# Altium schematic sheet 智能灯.SchDoc
size A4
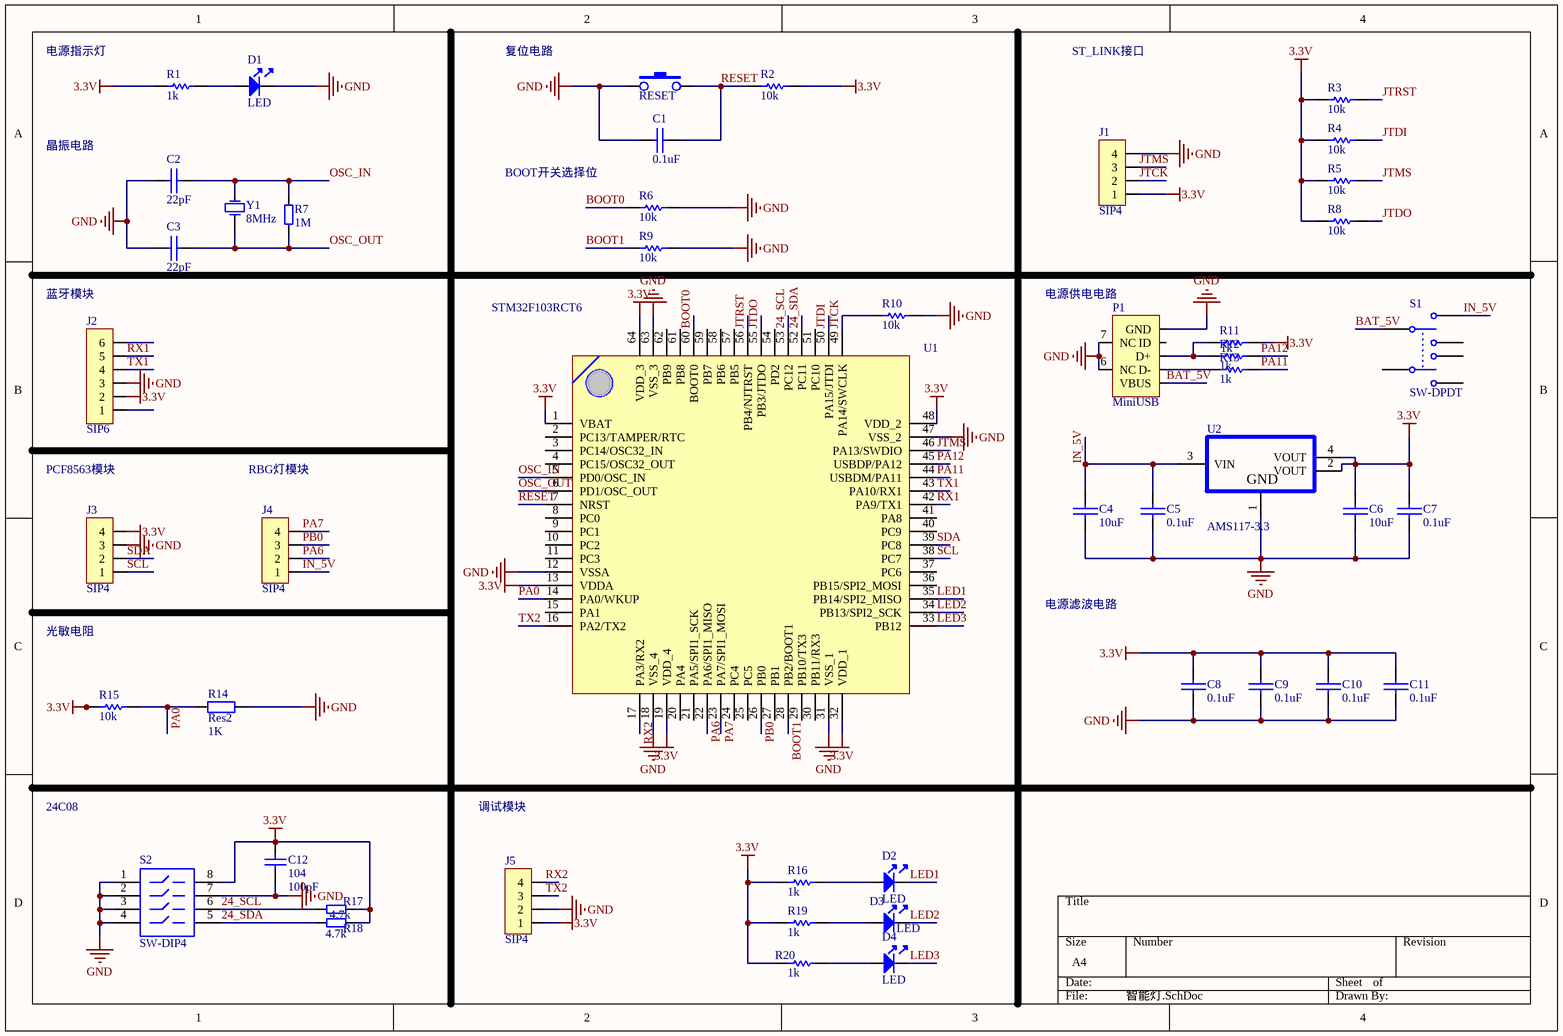
[diagram p0: 智能灯.SchDoc]

## Parts
C1  0.1uF  [0805c]
C2  22pF  [0805c]
C3  22pF  [0805c]
C4  10uF  [0805c]
C5  0.1uF  [0805c]
C6  10uF  [0805c]
C7  0.1uF  [0805c]
C8  0.1uF  [0805c]
C9  0.1uF  [0805c]
C10  0.1uF  [0805c]
C11  0.1uF  [0805c]
C12  104  value 100pF  [0805C]
D1  LED  [0805d]
D2  LED  [0805d]
D3  LED  [0805d]
D4  LED  [0805d]
J1  SIP4  [P4_2.54-1]
J2  SIP6  [P6_2.54-3]
J3  SIP4  [P4_2.54-3]
J4  SIP4  [P4_2.54-1]
J5  SIP4  [P4_2.54-1]
P1  MiniUSB  [USB_MINI_5P]
R1  1k  [0805r]
R2  10k  [0805r]
R3  10k  [0805r]
R4  10k  [0805r]
R5  10k  [0805r]
R6  10k  [0805r]
R7  1M  [0805R]
R8  10k  [0805r]
R9  10k  [0805r]
R10  10k  [0805r]
R11  1k  [0805r]
R12  1k  [0805r]
R13  1k  [0805r]
R14  Res2  value 1K  [AXIAL0.3]
R15  10k  [0805R]
R16  1k  [0603R]
R17  4.7k  [0805R]
R18  4.7k  [0805R]
R19  1k  [0603R]
R20  1k  [0603R]
RESET  SW-PB_DIP  [KEY_SIM2P]  (value not drawn)
S1  SW-DPDT  [DPDT-6]
S2  SW-DIP4  [DIP-8]
U1  STM32F103RCT6  [LQFP64-0.5MM]
U2  AMS117-3.3  [SOT-223]
Y1  8MHz  [0.1UF]

## Nets
3.3V: C6.1 C7.1 C8.1 C9.1 C10.1 C11.1 C12.2 J1.1 J2.2 J3.4 J5.1 R1.1 R2.2 R3.1 R4.1 R5.1 R8.1 R11.2 R15.1 R16.1 R17.2 R18.2 R19.1 R20.1 S2.8 U1.1(VBAT) U1.13(VDDA) U1.19(VDD_4) U1.32(VDD_1) U1.48(VDD_2) U1.64(VDD_3) U2.2(VOUT) U2.4(VOUT)
GND: C1.2 C2.1 C3.1 C4.2 C5.2 C6.2 C7.2 C8.2 C9.2 C10.2 C11.2 C12.1 D1.2 J1.4 J2.3 J3.3 J5.2 P1.5(GND) P1.6(NC) P1.7(NC) R6.2 R9.2 R10.2 R14.2 RESET.1 S2.1 S2.2 S2.3 S2.4 S2.7 U1.12(VSSA) U1.18(VSS_4) U1.31(VSS_1) U1.47(VSS_2) U1.63(VSS_3) U2.1(GND)
24_SCL: R17.1 S2.6 U1.53(PC12)
24_SDA: R18.1 S2.5 U1.52(PC11)
BAT_5V: P1.1(VBUS) S1.1
BOOT0: R6.1 U1.60(BOOT0)
BOOT1: R9.1 U1.28(PB2/BOOT1)
IN_5V: C4.1 C5.1 J4.1 S1.2 U2.3(VIN)
JTCK: J1.2 R10.1 U1.49(PA14/SWCLK)
JTDI: R4.2 U1.50(PA15/JTDI)
JTDO: R8.2 U1.55(PB3/JTDO)
JTMS: J1.3 R5.2 U1.46(PA13/SWDIO)
JTRST: R3.2 U1.56(PB4/NJTRST)
LED1: D2.2 U1.35(PB14/SPI2_MISO)
LED2: D3.2 U1.34(PB13/SPI2_SCK)
LED3: D4.2 U1.33(PB12)
OSC_IN: C2.2 R7.1 U1.5(PD0/OSC_IN) Y1.2(OSC2)
OSC_OUT: C3.2 R7.2 U1.6(PD1/OSC_OUT) Y1.1(OSC1)
PA0: R14.1 R15.2 U1.14(PA0/WKUP)
PA6: J4.2 U1.22(PA6/SPI1_MISO)
PA7: J4.4 U1.23(PA7/SPI1_MOSI)
PA11: R13.2 U1.44(USBDM/PA11)
PA12: R12.2 U1.45(USBDP/PA12)
PB0: J4.3 U1.26(PB0)
RESET: C1.1 R2.1 RESET.2 U1.7(NRST)
RX1: J2.5 U1.42(PA9/TX1)
RX2: J5.4 U1.17(PA3/RX2)
SCL: J3.1 U1.38(PC7)
SDA: J3.2 U1.39(PC8)
TX1: J2.4 U1.43(PA10/RX1)
TX2: J5.3 U1.16(PA2/TX2)
NetD1_1: D1.1 R1.2
NetD2_1: D2.1 R16.2
NetD3_1: D3.1 R19.2
NetD4_1: D4.1 R20.2
NetP1_2: P1.2(D-) R13.1
NetP1_3: P1.3(D+) R11.1 R12.1

Not connected (* = marked no-connect by the designer): J2 1 6; P1 4(ID); S1 3 4 5 6; U1 2(PC13/TAMPER/RTC) 3(PC14/OSC32_IN) 4(PC15/OSC32_OUT) 8(PC0) 9(PC1) 10(PC2) 11(PC3) 15(PA1) 20(PA4) 21(PA5/SPI1_SCK) 24(PC4) 25(PC5) 27(PB1) 29(PB10/TX3) 30(PB11/RX3) 36(PB15/SPI2_MOSI) 37(PC6) 40(PC9) 41(PA8) 51(PC10) 54(PD2) 57(PB5) 58(PB6) 59(PB7) 61(PB8) 62(PB9)

## Notes on the sheet
- 电源指示灯
- 复位电路
- ST_LINK接口
- 晶振电路
- BOOT开关选择位
- 蓝牙模块
- (near P1) 电源供电电路
- PCF8563模块
- RBG灯模块
- 光敏电阻
- 电源滤波电路
- 24C08
- 调试模块

## Library data of the parts
C1-C11 = CAP: Capacitor/小容量电容
C12 = Cap: Capacitor; Published: 8-Jun-2000; LatestRevisionDate: 17-Jul-2002; LatestRevisionNote: Re-released for DXP Platform.; PackageReference: RAD-0.3; Publisher: Altium Limited; PackageDescription: Radial Cap, Thru-Hole; 2 Leads; 0.3 in Pin Spacing
R1-R6 R8-R13 = Res
R7 R17 R18 = Res1
R14 = Res2: Resistor; Published: 8-Jun-2000; LatestRevisionDate: 17-Jul-2002; LatestRevisionNote: Re-released for DXP Platform.; PackageReference: AXIAL-0.4; Publisher: Altium Limited; PackageDescription: Axial Device, Thru-Hole; 2 Leads; 0.4 in Pin Spacing
R15 = Res_1
R16 R19 R20 = Res_2
S1 = SW-DPDT: Double-Pole, Double-Throw Switch; Published: 24-Mar-1999; LatestRevisionDate: 17-Jul-2002; LatestRevisionNote: Re-released for DXP Platform.; PackageReference: DPDT-6; Publisher: Altium Limited; PackageDescription: Switch; 6 Leads
S2 = SW-DIP4: DIP Switch; Published: 24-Mar-1999; LatestRevisionDate: 17-Jul-2002; LatestRevisionNote: Re-released for DXP Platform.; PackageReference: DIP-8; Publisher: Altium Limited
U1 = STM32F103RD: LQFP64
Y1 = J晶振-3